# Altium schematic sheet LM2596MOD.SchDoc
size A4
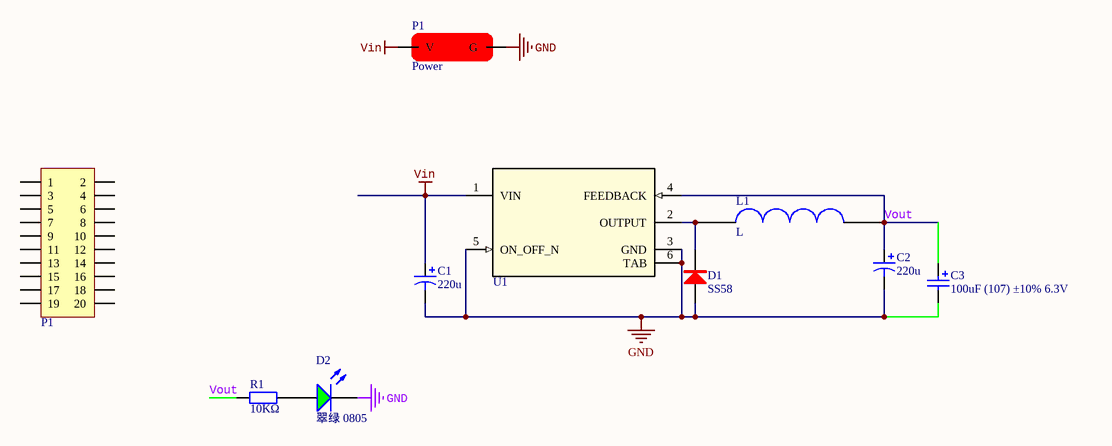
[diagram p0: LM2596MOD.SchDoc]

## Parts
(Parts that share a designator on the sheet are numbered #1, #2 ... from top to bottom, then left to right.)
C1  220u  [CM F(10*10.2)]
C2  220u  [CM F(10*10.2)]
C3  100uF (107) ±10% 6.3V  [CASE-B_3528]
D1  SS58  [SMA]
D2  翠绿 0805  [0805_LED_S1]
L1  L  [CDRH127]
P1#1  Power  [DC-005]
P1#2  Header 2X10  [TB2.54 10x2]  (value not drawn)
R1  10KΩ  [0805_R]
U1  LM2596  [TO263]  (value not drawn)

## Nets
GND: C1.2 C2.2 C3.2 D1.1(A) D2.K P1#1.2(G) U1.3(GND) U1.5(ON_OFF_N) U1.6(TAB)
Vin: C1.1 P1#1.1(V) U1.1(VIN)
Vout: C2.1 C3.1 L1.2 R1.1 U1.4(FEEDBACK)
NetD1_2: D1.2(K) L1.1 U1.2(OUTPUT)
NetD2_A: D2.A R1.2

Not connected (* = marked no-connect by the designer): P1#2 1 2 3 4 5 6 7 8 9 10 11 12 13 14 15 16 17 18 19 20

## Library data of the parts
C1 C2 = Cp: Polarized Capacitor (Axial); Published: 8-Jun-2000; LatestRevisionDate: 17-Jul-2002; LatestRevisionNote: Re-released for DXP Platform.; PackageReference: POLAR0.8; Publisher: Altium Limited; PackageDescription: Polarized Capacitor; 2 Leads
C3 = 3528 100uF (107) 10% 6.3V: 钽电容; ComponentLink1Description: 供应商链接; ComponentLink1URL: http://www.szlcsc.com/product/details_16815.html; Package: 3528; Supplier: LC; SuppliersPartNumber: C16133
D1 = Dz: 整流二极管; 版权归属: 源创客; BOM名称: 整流二极管; 学习资源: www.ooocke.com
D2 = 0805 翠绿: 发光二极管; ComponentLink1Description: 供应商链接; ComponentLink1URL: http://www.szlcsc.com/product/details_2670.html; Package: 0805; Supplier: LC; SuppliersPartNumber: C2297
P1#2 = Header 10X2: 10*2P接插件; 版权归属: 源创客; BOM名称: 10*2P接插件; 学习资源: www.ooocke.com
R1 = 0805 10KΩ (1002) 1%: 贴片电阻; ComponentLink1Description: 供应商链接; ComponentLink1URL: http://www.szlcsc.com/product/details_18102.html; Package: 0805; Supplier: LC; SuppliersPartNumber: C17414
U1 = LM2596: Imported; PartNumber: LM2596SX-ADJ/NOPB; Alternate_PartNumber: LM2596S-ADJ/NOPB; Manufacturer: Texas Instruments; CompType: IC; PIN_COUNT: 6; PackageReference: KTT0005B; MountType: SMT; RoHS: Y; RefDes: RefDes; TYPE: TYPE; Value: Value